# EasyEDA Pro project 轮足机器人主板&核心板.epro, schematic Schematic3
Board Name: 卡座主板V5.0; Create Date: 2025-03-28; Page Name: P1; Project Name: 轮足机器人主板&核心板; Schematic Name: Schematic3; Update Date: 2025-04-25; Company: 海思路999号412所; Drawed: YienMaster; Page Size: A4; Version: V3.0
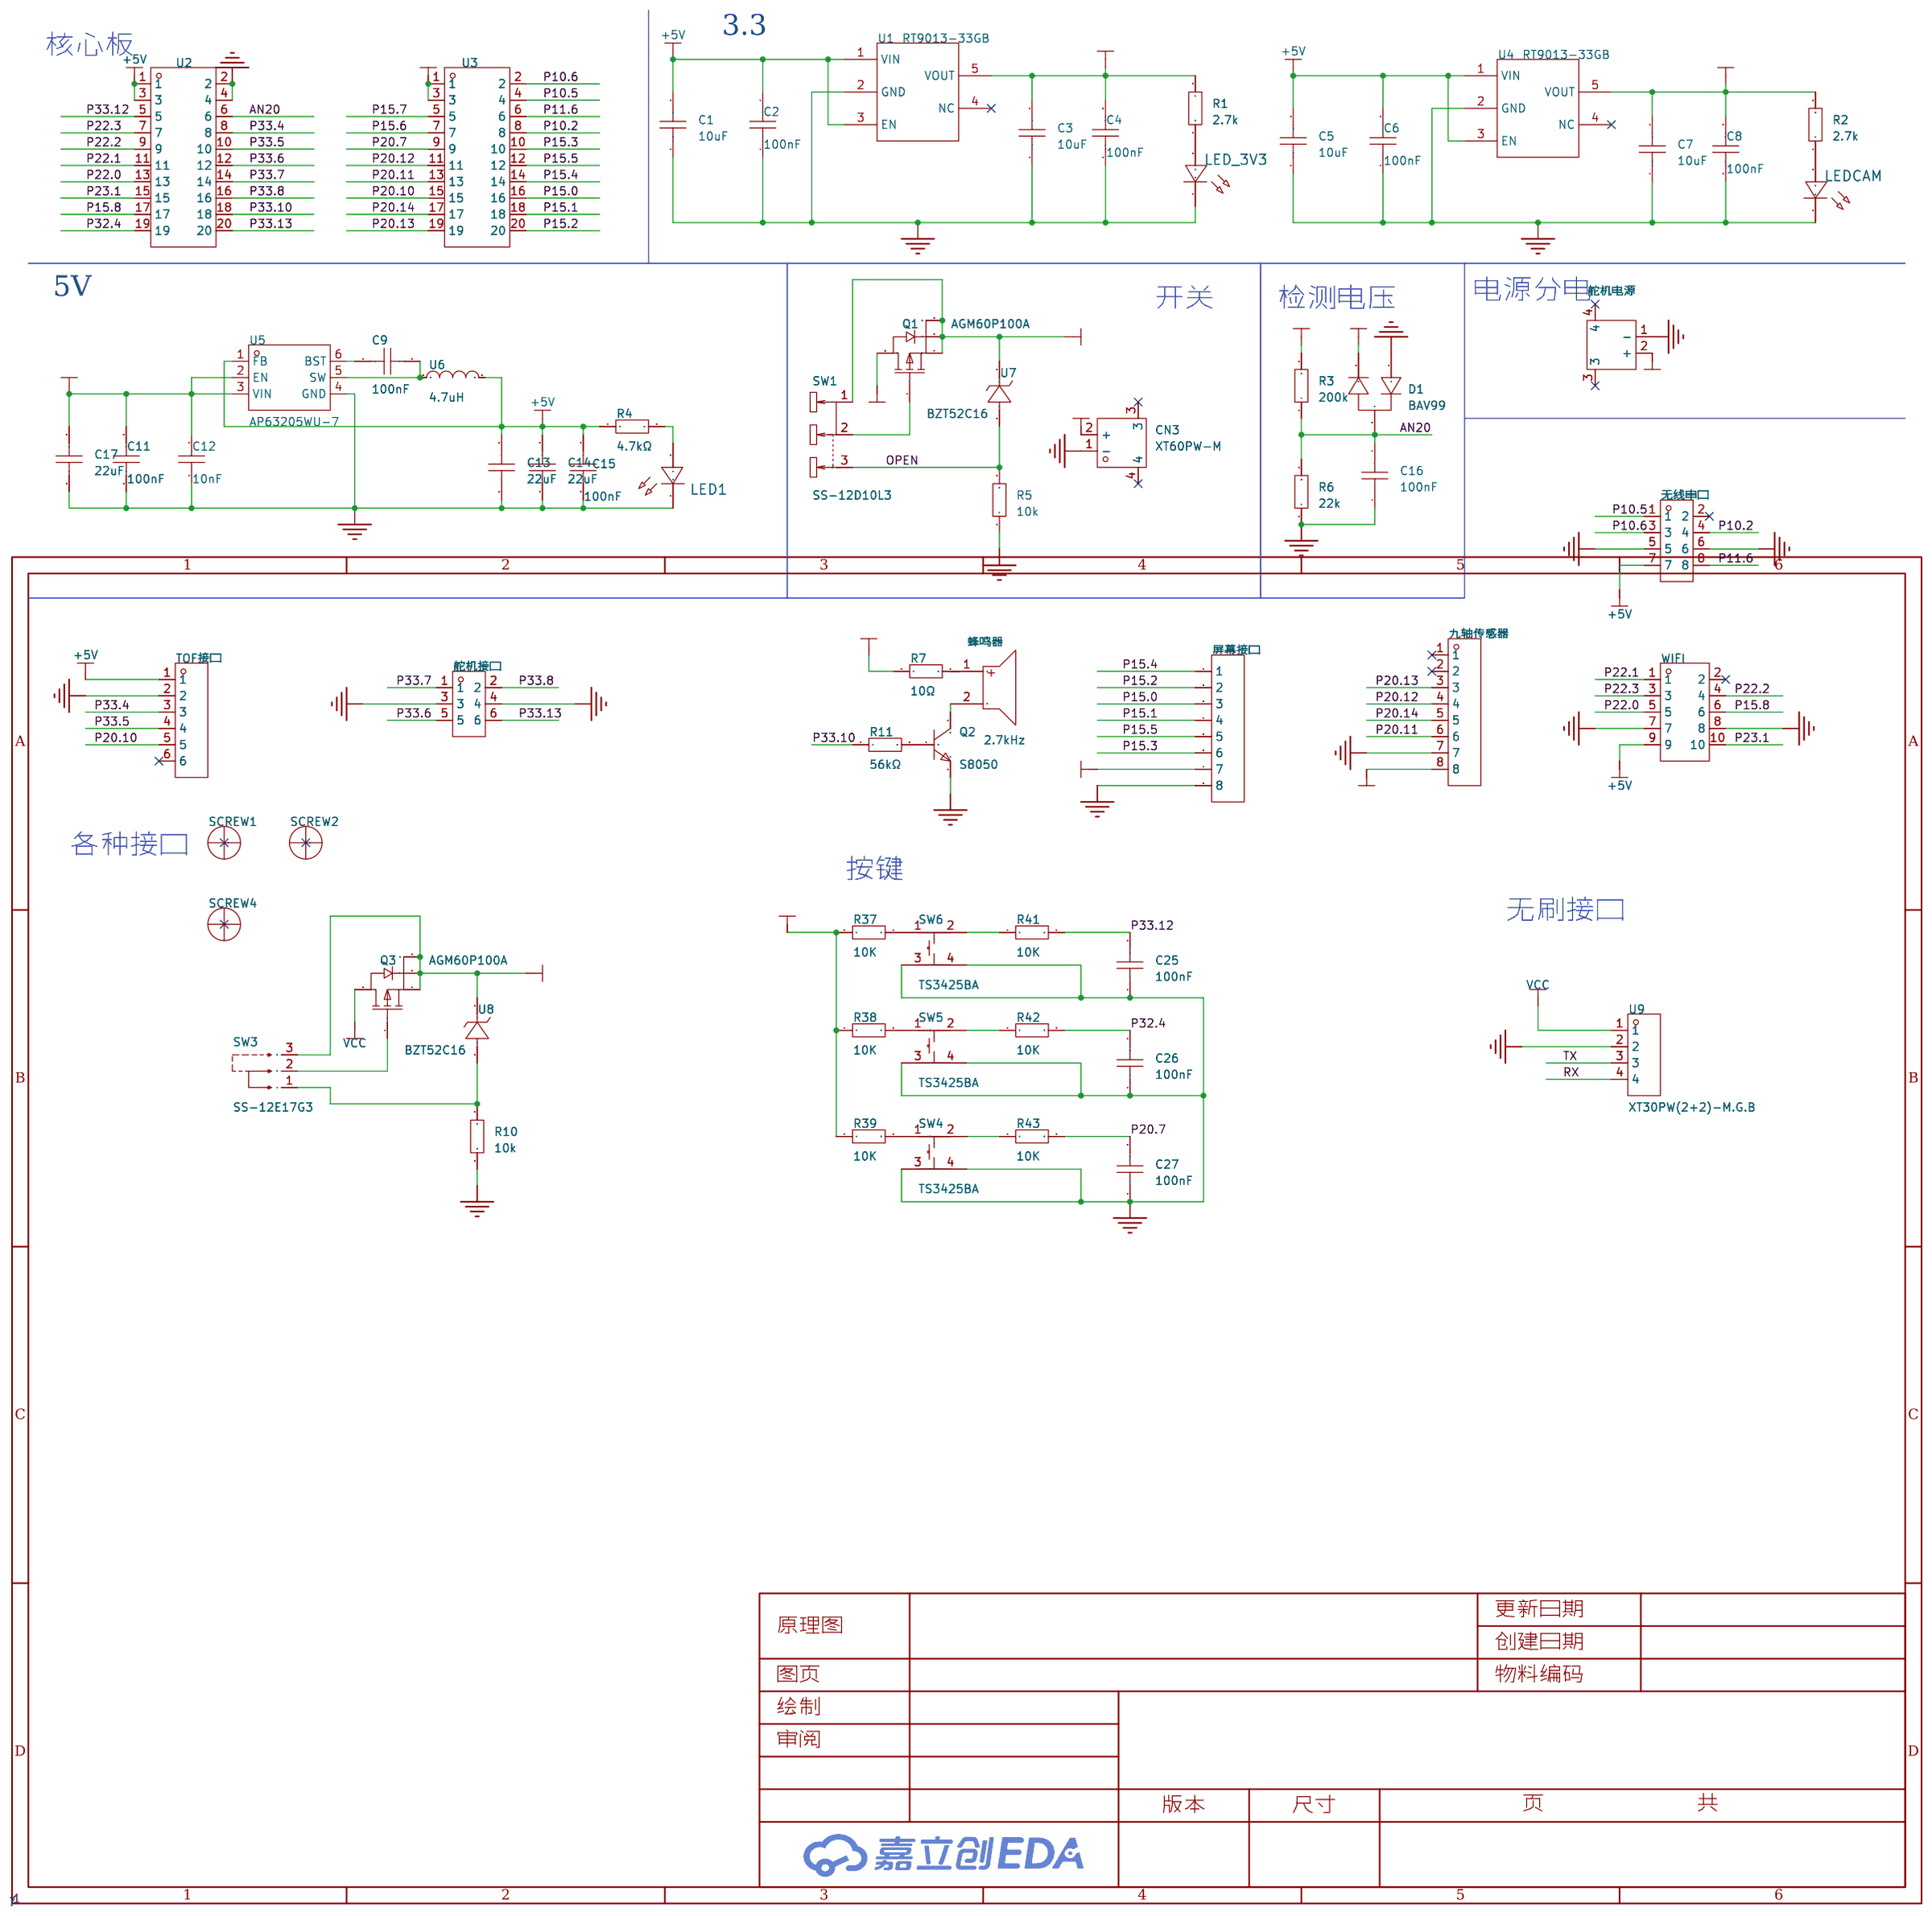
[diagram p6: schematic sheet]

## Parts
C1  10uF  [C0603]
C2  100nF  [C0603]
C3  10uF  [C0603]
C4  100nF  [C0603]
C5  10uF  [C0603]
C6  100nF  [C0603]
C7  10uF  [C0603]
C8  100nF  [C0603]
C9  100nF  [C0603]
C11  100nF  [C0603]
C12  10nF  [C0603]
C13  22uF  [C0805]
C14  22uF  [C0805]
C15  100nF  [C0603]
C16  100nF  [C0603]
C17  22uF  [C0805]
C25  100nF  [C0603]
C26  100nF  [C0603]
C27  100nF  [C0603]
CN3  XT60PW-M  [CONN-TH_XT60PW-M]
D1  BAV99  [SOT-23_L2.9-W1.3-P1.90-LS2.4-BR]
LED1  -  [LED_0603]
LED_3V3  -  [LED_0603]
LEDCAM  -  [LED_0603]
Q1  AGM60P100A  [TDSON-8_L5.9-W5.2-P1.27-BL]
Q2  S8050  [SOT-23-3_L2.9-W1.6-P1.90-LS2.8-BR]
Q3  AGM60P100A  [TDSON-8_L5.9-W5.2-P1.27-BL]
R1  2.7k  [R0603]
R2  2.7k  [R0603]
R3  200k  [R0603]
R4  4.7kΩ  [R0603]
R5  10k  [R0603]
R6  22k  [R0603]
R7  10Ω  [R0603]
R10  10k  [R0603]
R11  56kΩ  [R0603]
R37  10K  [R0603]
R38  10K  [R0603]
R39  10K  [R0603]
R41  10K  [R0603]
R42  10K  [R0603]
R43  10K  [R0603]
SCREW1  -  [M3螺丝]
SCREW2  -  [M3螺丝]
SCREW4  -  [M3螺丝]
SW1  SS-12D10L3  [SW-TH_SS-12D10L3]
SW3  SS-12E17G3  [SW-TH_HOOYA_SS-12E17G3]
SW4  TS3425BA  [SW-SMD_4P-L4.2-W3.2-P2.15-LS4.6-1]
SW5  TS3425BA  [SW-SMD_4P-L4.2-W3.2-P2.15-LS4.6-1]
SW6  TS3425BA  [SW-SMD_4P-L4.2-W3.2-P2.15-LS4.6-1]
TOF接口  ZX-XH2.54-6PWZ  [CONN-TH_6P-P2.50_ZX-XH2.54-6PWZ]
U1  RT9013-33GB  [SOT-23-5_L3.0-W1.7-P0.95-LS2.8-BL]
U2  PM254-2-10-Z-8.5  [HDR-TH_20P-P2.54-V-F-R2-C10-S2.54]
U3  PM254-2-10-Z-8.5  [HDR-TH_20P-P2.54-V-F-R2-C10-S2.54]
U4  RT9013-33GB  [SOT-23-5_L3.0-W1.7-P0.95-LS2.8-BL]
U5  AP63205WU-7  [TSOT-23-6_L2.9-W1.6-P0.95-LS2.8-BL]
U6  4.7uH  [IND-SMD_L3.0-W3.0_FTC303020D]
U7  BZT52C16  [SOD-123_L2.7-W1.6-LS3.8-RD]
U8  BZT52C16  [SOD-123_L2.7-W1.6-LS3.8-RD]
U9  XT30PW(2+2)-M.G.B  [CONN-TH_4P-XT30PW-M]
WIFI  2541FV-2x5P  [HDR-TH_10P-P2.54-V-F-R2-C5-S2.54]
九轴传感器  PZ254V-11-08P  [HDR-TH_8P-P2.54-V-M]
屏幕接口  2.54-1*8P母环保  [HDR-TH_8P-P2.54-V-F-1]
无线串口  2541FV-2x4P  [HDR-TH_8P-P2.54-V-F-R2-C4-S2.54]
舵机接口  BH254V-6P  [IDC-TH_6P-P2.54-V-R2-C3-S2.54]
舵机电源  XT30PW-M30.G.Y  [CONN-TH_XT30PW-M]
蜂鸣器  2.7kHz  [BUZ-TH_BD9.0-P4.00-D0.6-FD]

## Library data of the parts
C1 C3 C5 C7 = CGA0603X5R106K100JT: 容值:10uF;精度:±10%;额定电压:10V;材质(温度系数):X5R;; LCSC Part Name: 10uF ±10% 10V; Supplier Part: C6119842; Manufacturer: HRE(芯声); Supplier Footprint: 0603; JLCPCB Part Class: 扩展库; Supplier: LCSC; Tolerance: ±10%; Voltage Rated: 10V; Temperature Coefficient: X5R
C2 C4 C6 C8 = CC0603KRX7R9BB104: 容值:100nF;精度:±10%;额定电压:50V;材质(温度系数):X7R;; LCSC Part Name: 100nF ±10% 50V; Supplier Part: C14663; Manufacturer: YAGEO(国巨); Supplier Footprint: 0603; JLCPCB Part Class: 基础库; Datasheet: https://atta.szlcsc.com/upload/public/pdf/source/20180910/C282072_33301C7F631E79921B82A8DAC6BCC5B3.pdf; Supplier: LCSC; Tolerance: ±10%; Voltage Rated: 50V; Temperature Coefficient: X7R
C9 C11 C15 = CGA0603X7R104K500JT: 容值:100nF;精度:±10%;额定电压:50V;材质(温度系数):X7R;; LCSC Part Name: 100nF ±10% 50V; Supplier Part: C6119867; Manufacturer: HRE(芯声); Supplier Footprint: 0603; JLCPCB Part Class: 扩展库; Supplier: LCSC; Tolerance: ±10%; Voltage Rated: 50V; Temperature Coefficient: X7R
C12 = CC0603KRX7R9BB103: 容值:10nF;精度:±10%;额定电压:50V;材质(温度系数):X7R;; LCSC Part Name: 10nF ±10% 50V; Supplier Part: C100042; Manufacturer: YAGEO(国巨); Supplier Footprint: 0603; JLCPCB Part Class: 扩展库; Datasheet: https://atta.szlcsc.com/upload/public/pdf/source/20181008/C309510_22F155564471FAF6A489F7D68F34234E.pdf; Supplier: LCSC; Tolerance: ±10%; Voltage Rated: 50V; Temperature Coefficient: X7R
C13 C14 C17 = CGA0805X5R226M350MT: 容值:22uF;精度:±20%;额定电压:35V;材质(温度系数):X5R;; LCSC Part Name: 22uF ±20% 35V; Supplier Part: C6119901; Manufacturer: HRE(芯声); Supplier Footprint: 0805; JLCPCB Part Class: 扩展库; Datasheet: https://atta.szlcsc.com/upload/public/pdf/source/20231129/D589D0CC4D260F7AC3A77E53B455CCB3.pdf; Supplier: LCSC; Tolerance: ±20%; Voltage Rated: 35V; Temperature Coefficient: X5R
C16 C25-C27 = CAP_0603: Supplier Footprint: 0603
CN3 = XT60PW-M: 类别:-;类型1:-;; LCSC Part Name: AMASS(艾迈斯)航模插头xt60连接器150公母对接pw锂电池公头 板插卧式XT60PW-M; Supplier Part: C98732; Manufacturer: AMASS(艾迈斯); JLCPCB Part Class: 扩展库; Datasheet: https://atta.szlcsc.com/upload/public/pdf/source/20240118/44A3DCFF53BE25DC65378AFFB21277A4.pdf; Supplier: LCSC; Brand: 艾迈斯; Type: 卧式插头; Colour: 黄色; InterfaceType: 公头
D1 = BAV99_C408392: 二极管配置:1对串联式;正向压降(Vf):1.25V@150mA;直流反向耐压(Vr):70V;整流电流:200mA;反向恢复时间(trr):6ns;; LCSC Part Name: 电压:70V 电流:200mA; Supplier Part: C408392; Manufacturer: MDD(辰达半导体); Supplier Footprint: SOT-23; JLCPCB Part Class: 扩展库; Datasheet: https://atta.szlcsc.com/upload/public/pdf/source/20240710/712A41600A6652723ABF2FD56C16FE3C.pdf; Supplier: LCSC; Diode Configuration: 1对串联式; Forward Voltage (Vf@If): 1.25V@150mA; Reverse Voltage (Vr): 70V; Rectified Current: 200mA; Reverse Leakage Current: 2.5uA@70V; Reverse Recovery Time (trr): 6ns
LED1 LED_3V3 LEDCAM = LED_0603-R: Supplier Footprint: 0603
Q1 Q3 = AGM60P100A: 类型:1个P沟道;漏源电压(Vdss):60V;连续漏极电流(Id):100A;导通电阻(RDS(on)@Vgs,Id):5.5mΩ@10V,15A;功率(Pd):150W;阈值电压(Vgs(th)@Id):2V@250uA;; LCSC Part Name: 1个P沟道 耐压:60V 电流:100A; Supplier Part: C5373096; Manufacturer: AGM-Semi(芯控源); Supplier Footprint: PDFN-8(5x6); JLCPCB Part Class: 扩展库; Datasheet: https://atta.szlcsc.com/upload/public/pdf/source/20241108/A068B77F4A82E836D758702AA2819D88.pdf; Supplier: LCSC; Type: 1个P沟道; Drain Source Voltage (Vdss): 60V; Continuous Drain Current (Id): 100A; Drain Source On Resistance (RDS(on)@Vgs,Id): 5.5mΩ@10V,15A; Power Dissipation (Pd): 150W; Gate Threshold Voltage (Vgs(th)@Id): 2V@250uA; Total Gate Charge (Qg@Vgs): 56nC@10V; Operating Temperature: -55℃~+150℃@(Tj)
Q2 = S8050_C181158: 晶体管类型:NPN;集电极电流(Ic):500mA;集射极击穿电压(Vceo):25V;功率(Pd):300mW;; LCSC Part Name: NPN 电流:500mA 耐压:25V; Supplier Part: C181158; Manufacturer: Hottech(合科泰); Supplier Footprint: SOT-23; JLCPCB Part Class: 扩展库; Datasheet: https://atta.szlcsc.com/upload/public/pdf/source/20220506/D987F39D56F2975D34EC7947E75C4ABC.pdf; Supplier: LCSC; Transistor Type: NPN; Collector Current (Ic): 500mA; Collector-Emitter Breakdown Voltage (Vceo): 25V; Power Dissipation (Pd): 300mW; Transition Frequency (fT): 150MHz; Collector Cut-Off Current (Icbo): 100nA; Collector-Emitter Saturation Voltage (VCE(sat)@Ic,Ib): 600mV@500mA,50mA
R1-R3 R5 R6 R10 R37-R39 R41-R43 = Res_0603: Supplier Footprint: 0603
R4 = 0603WAF4701T5E: 电阻类型:厚膜电阻;阻值:4.7kΩ;精度:±1%;功率:100mW;最大工作电压:75V;温度系数:±100ppm/℃;; LCSC Part Name: 4.7kΩ ±1% 100mW 厚膜电阻; Supplier Part: C23162; Manufacturer: UNI-ROYAL(厚声); Supplier Footprint: 0603; JLCPCB Part Class: 基础库; Datasheet: https://atta.szlcsc.com/upload/public/pdf/source/20200306/C422600_1E6D84923E4A46A82E41ADD87F860B5C.pdf; Supplier: LCSC; Type: 厚膜电阻; Tolerance: ±1%; Power(Watts): 100mW; Overload Voltage (Max): 75V; Temperature Coefficient: ±100ppm/℃; Operating Temperature Range: -55℃~+155℃
R7 = 0603WAF100JT5E: 电阻类型:厚膜电阻;阻值:10Ω;精度:±1%;功率:100mW;最大工作电压:75V;温度系数:±400ppm/℃;; LCSC Part Name: 10Ω ±1% 100mW 厚膜电阻; Supplier Part: C22859; Manufacturer: UNI-ROYAL(厚声); Supplier Footprint: 0603; JLCPCB Part Class: 基础库; Datasheet: https://atta.szlcsc.com/upload/public/pdf/source/20200306/C422600_1E6D84923E4A46A82E41ADD87F860B5C.pdf; Supplier: LCSC; Type: 厚膜电阻; Tolerance: ±1%; Power(Watts): 100mW; Overload Voltage (Max): 75V; Temperature Coefficient: ±400ppm/℃; Operating Temperature Range: -55℃~+155℃
R11 = 0603WAF5602T5E: 电阻类型:厚膜电阻;阻值:56kΩ;精度:±1%;功率:100mW;最大工作电压:75V;温度系数:±100ppm/℃;; LCSC Part Name: 56kΩ ±1% 100mW 厚膜电阻; Supplier Part: C23206; Manufacturer: UNI-ROYAL(厚声); Supplier Footprint: 0603; JLCPCB Part Class: 基础库; Datasheet: https://atta.szlcsc.com/upload/public/pdf/source/20200306/C422600_1E6D84923E4A46A82E41ADD87F860B5C.pdf; Supplier: LCSC; Type: 厚膜电阻; Tolerance: ±1%; Power(Watts): 100mW; Overload Voltage (Max): 75V; Temperature Coefficient: ±100ppm/℃; Operating Temperature Range: -55℃~+155℃
SCREW1 SCREW2 SCREW4 = M3螺丝: Check: false
SW1 = SS-12D10L3: 电路结构:单刀双掷;安装方式:直插;开关颜色:黑色;额定电流(DC):3A;额定电压(DC):125V;额定电流(AC):3A;额定电压(AC):125V;机械寿命:1万次;; LCSC Part Name: 柄长3mm 直插双档 滑动开关; Supplier Part: C319013; Manufacturer: XKB Connectivity(中国星坤); Supplier Footprint: 插件; JLCPCB Part Class: 扩展库; Datasheet: https://atta.szlcsc.com/upload/public/pdf/source/20211009/D6412F37AABE6F9459A6EE7FA4DAEADB.pdf; Supplier: LCSC; Circuit: 单刀双掷; Actuator Style: 矩形柱状; Pin Style: PC引脚; Switch Length: 13mm; Switch Width: 6.8mm; Switch Height: 6.4mm; Mounting Style: 直插; Actuator Color: 黑色; Current Rating (DC): 3A; Voltage Rating (DC): 125V; Current Rating (AC): 3A; Voltage Rating (AC): 125V; Mechanical Life: 1万次; Operating Temperature: -40℃~+85℃
SW3 = SS-12E17G3: 单排正拨3脚立式拨动开关滑动开关; Supplier Part: C2939320; Manufacturer: HOOYA(皓宇电子); Supplier Footprint: 插件,4.1x11.6mm; JLCPCB Part Class: 扩展库; Datasheet: https://atta.szlcsc.com/upload/public/pdf/source/20220518/A9354BB9F65922345E6D18CC46FE6A81.pdf; Supplier: LCSC
SW4-SW6 = TS3425BA: 电路结构:单刀单掷;按钮形状:椭圆形按钮;作用力:250gf;安装方式:立贴;开关长度:4.2mm;开关宽度:3.2mm;开关高度:2.5mm;带支架:不带;触点电流:50mA;额定电压(DC):12V;绝缘电阻:100MΩ;机械寿命:10万次;; LCSC Part Name: 4.2*3.2*2.5mm 立贴 轻触开关; Supplier Part: C2681476; Manufacturer: SHOU HAN(首韩); Supplier Footprint: SMD; JLCPCB Part Class: 扩展库; Datasheet: https://atta.szlcsc.com/upload/public/pdf/source/20210107/C2681476_BF217B2301F0070AA49504CB0BFDE895.pdf; Supplier: LCSC; Circuit: 单刀单掷; Actuator Style: 椭圆形按钮; Operating Force: 250gf; Mounting Style: 立贴; Switch Length: 4.2mm; Switch Width: 3.2mm; Switch Height: 2.5mm; Strike Gundam: 不带; Contact Current: 50mA; Voltage Rating (DC): 12V; Insulation Resistance: 100MΩ; Actuator/Cap Color: 白色; Pin Style: J型引脚; Mechanical Life: 10万次; Operating Temperature: -20℃~+85℃
TOF接口 = ZX-XH2.54-6PWZ: 插针结构:1x6P;间距:2.5mm;安装方式:弯插;参考系列:XH;总PIN数:6P;排数:1;每排PIN数:6;行距:-;额定电流:3A;触头材质:黄铜;触头镀层:锡;工作温度范围:-25℃~+85℃;; LCSC Part Name: 1x6P 间距:2.5mm 弯插 系列:XH; Supplier Part: C7429645; Manufacturer: Megastar(兆星); Supplier Footprint: 弯插,P=2.5mm; JLCPCB Part Class: Extended Part; Datasheet: https://atta.szlcsc.com/upload/public/pdf/source/20230619/9057EB94260093B1525D11E652DE2D7A.pdf; Supplier: LCSC; Pins Structure: 1x6P; Pitch: 2.5mm; Mounting Type: 弯插; Reference Series: XH; Number of Pins: 6P; Number of Rows: 1; Number of PINs Per Row: 6; Rated Current: 3A; Contact Material: 黄铜; Contact Plating: 锡; Operating Temperature: -25℃~+85℃; Rated Voltage (Max): 250V; Plastic Material: PA66; Flame Retardant Rating: UL94V-0; Color: 白色; Z-Height of the Board: 5.9mm; X-Length of Bottom Edge on Board (Spacing Line): 17.5mm; Y-Width of Bottom Edge on Board: 7.32mm
U1 U4 = RT9013-33GB: 输出类型:固定;最大输入电压:5.5V;输出电压:3.3V;最大输出电流:500mA;电源纹波抑制比(PSRR):50dB@(10kHz);输出极性:正极;; LCSC Part Name: 输入5.5V 输出3.3V 500mA; Supplier Part: C47773; Manufacturer: RICHTEK(立锜); Supplier Footprint: SOT-23-5; JLCPCB Part Class: 扩展库; Datasheet: https://atta.szlcsc.com/upload/public/pdf/source/20150504/1457707282459.pdf; Supplier: LCSC; Output Type: 固定; Maximum Input Voltage: 5.5V; Output Voltage: 3.3V; MAX Output Current: 500mA; Power Supply Rejection Ratio (PSRR): 50dB@(10kHz); Dropout Voltage: 400mV@(500mA); standby current: 50uA; Operating Temperature: -40℃~+85℃; Output Polarity: 正极; Number of Outputs: 1
U2 U3 = PM254-2-10-Z-8.5: 插孔结构:2x10P;间距:2.54mm;行距:2.54mm;圆孔/方孔:方孔;安装类型:直插;排数:双排;总孔位数:20P;额定电流:3A;额定电压:-;插孔方向:顶部;塑高:8.5mm;触头材质:铜合金;工作温度范围:-40℃~+105℃;焊接温度(最大值):260℃@5S;; LCSC Part Name: 2x10P 间距:2.54mm 直插; Supplier Part: C2897411; Manufacturer: HCTL(华灿天禄); Supplier Footprint: 插件,P=2.54mm; JLCPCB Part Class: 扩展库; Datasheet: https://atta.szlcsc.com/upload/public/pdf/source/20230609/3D36CA2C1BFC9FD1C3F709AD9DFEB9C2.pdf; Supplier: LCSC; Holes Structure: 2x10P; Pitch: 2.54mm; Row Spacing: 2.54mm; Circular Hole / Square Hole: 方孔; Mounting Type: 直插; Number of Rows: 双排; Number of Holes: 20P; Current Rating (Max): 3A; Holes Direction: 顶部; Insulation Height: 8.5mm; Contact Material: 铜合金; Operating Temperature Range: -40℃~+105℃; Soldering Temperature(Max): 260℃@5S
U5 = AP63205WU-7: 功能类型:降压型;输出类型:固定;输入电压:3.8V~32V;输出电压:5V;输出电流:2A;; LCSC Part Name: 3.8V至32V输入、2A低静态电流同步降压转换器，增强EMI抑制; Supplier Part: C2071056; Manufacturer: DIODES(美台); Supplier Footprint: TSOT-23-6; JLCPCB Part Class: 扩展库; Datasheet: https://atta.szlcsc.com/upload/public/pdf/source/20210622/C780769_099C67289BD3EC61AAFB52D8B07125B3.pdf; Supplier: LCSC; Function: 降压型; Output Type: 固定; Input Voltage: 3.8V~32V; Output Voltage: 5V; Output Current: 2A; Switching Frequency: 1.1MHz; Operating Temperature: -40℃~+85℃@(TA); Synchronous Rectification: 是; Number of Outputs: 1; Topology: 降压式; Quiescent Current (Iq): 22uA; Switch tube (built-in/external): 内置
U6 = FTC303018D4R7MBCA: 电感值:4.7uH;精度:±20%;额定电流:3.4A;饱和电流(Isat):4.7A;类型:一体成型电感;; LCSC Part Name: 4.7uH ±20% 4.7A; Supplier Part: C5832388; Manufacturer: cjiang(长江微电); Supplier Footprint: SMD,3x3mm; JLCPCB Part Class: 扩展库; Datasheet: https://atta.szlcsc.com/upload/public/pdf/source/20230602/8FFEDA9C0247A92A0D4B67554BFE4091.pdf; Supplier: LCSC; Tolerance: ±20%; Rated Current: 3.4A; Saturation Current (Isat): 4.7A; DC Resistance (DCR): 72mΩ; Type: 一体成型电感
U7 U8 = BZT52C16_C2903915: 二极管配置:独立式;稳压值(标称值):16V;稳压值(范围):15.3V~17.1V;功率(Pd):500mW;; Supplier Part: C2903915; Manufacturer: GOODWORK(固得沃克); Supplier Footprint: SOD-123; JLCPCB Part Class: 扩展库; Datasheet: https://atta.szlcsc.com/upload/public/pdf/source/20211009/D2D840BC467623069B519162AA0DC941.pdf; Supplier: LCSC; Diode Configuration: 独立式; Zener Voltage (Nom): 16V; Reverse Leakage Current (Ir): 100nA@11.2V; Zener Voltage (Range): 15.3V~17.1V; Power Dissipation: 500mW; Zener Impedance (Zzt): 40Ω
U9 = XT30PW(2+2)-M.G.B: LCSC Part Name: XT30PW(2+2)功率数据混合插头公金黑PCB弯插; Supplier Part: C19268030; Manufacturer: AMASS(艾迈斯); JLCPCB Part Class: 扩展库; Datasheet: https://atta.szlcsc.com/upload/public/pdf/source/20240112/A815AE62CB016131F8636555ECBDABF7.pdf; Supplier: LCSC
WIFI = 2541FV-2x5P: 插孔结构:2x5P;间距:2.54mm;圆孔/方孔:方孔;安装类型:直插;排数:双排;总孔位数:10P;额定电流:3A;额定电压:250V;插孔方向:顶部;工作温度范围:-40℃~+105℃;; LCSC Part Name: 间距:2.54mm 2x5P 直插; Supplier Part: C18723056; Manufacturer: HanElectricity(瀚源); Supplier Footprint: 插件,P=2.54mm; JLCPCB Part Class: 扩展库; Datasheet: https://atta.szlcsc.com/upload/public/pdf/source/20231018/348A30CBB18FAA04E40F2CE12A6EAA75.pdf; Supplier: LCSC; Holes Structure: 2x5P; Pitch: 2.54mm; Circular Hole / Square Hole: 方孔; Mounting Type: 直插; Number of Rows: 双排; Number of Holes: 10P; Current Rating (Max): 3A; Voltage Rating (Max): 250V; Holes Direction: 顶部; Operating Temperature Range: -40℃~+105℃
九轴传感器 = PZ254V-11-08P: 插针结构:1x8P;间距:2.54mm;行距:-;圆针/方针:方针;安装类型:直插;排数:单排;总PIN位数:8P;额定电流:-;额定电压:-;配合针长度:6mm;塑高:2.5mm;端接针长度:3mm;触头材质:黄铜;触头镀层:-;工作温度范围:-40℃~+105℃;颜色:黑色;; LCSC Part Name: 间距:2.54mm 1x8P 直插 方针; Supplier Part: C492407; Manufacturer: XFCN(兴飞); Supplier Footprint: 插件,P=2.54mm; JLCPCB Part Class: 扩展库; Datasheet: https://atta.szlcsc.com/upload/public/pdf/source/20200309/C492407_83A6FB26A2233368EDB9516968EC6149.pdf; Supplier: LCSC; Pin Structure: 1x8P; Pitch: 2.54mm; Circluar Pins/Square Pins: 方针; Mounting Type: 直插; Number of Rows: 单排; Number of Pins: 8P; Length of Mating Pin: 6mm; Insulation Height: 2.5mm; Length of End Connection Pin: 3mm; Contact Material: 黄铜; Operating Temperature Range: -40℃~+105℃; Color: 黑色
屏幕接口 = 2.54-1*8P母环保: 插孔结构:1x8P;间距:2.54mm;行距:-;安装类型:直插;排数:单排;总孔位数:8P;塑高:-;触头材质:-;触头镀层:-;; LCSC Part Name: 间距:2.54mm 1x8P 直插; Supplier Part: C27438; Manufacturer: BOOMELE(博穆精密); Supplier Footprint: 插件,P=2.54mm; JLCPCB Part Class: 扩展库; Datasheet: https://atta.szlcsc.com/upload/public/pdf/source/20231221/1CA800C6799ED97958773716FAA1BFFE.pdf; Supplier: LCSC; Holes Structure: 1x8P; Pitch: 2.54mm; Mounting Type: 直插; Number of Rows: 单排; Number of Holes: 8P
无线串口 = 2541FV-2x4P: 插孔结构:2x4P;间距:2.54mm;圆孔/方孔:方孔;安装类型:直插;排数:双排;总孔位数:8P;额定电流:3A;额定电压:250V;插孔方向:顶部;工作温度范围:-40℃~+105℃;; LCSC Part Name: 间距:2.54mm 2x4P 直插; Supplier Part: C18723055; Manufacturer: HanElectricity(瀚源); Supplier Footprint: 插件,P=2.54mm; JLCPCB Part Class: 扩展库; Datasheet: https://atta.szlcsc.com/upload/public/pdf/source/20231018/348A30CBB18FAA04E40F2CE12A6EAA75.pdf; Supplier: LCSC; Holes Structure: 2x4P; Pitch: 2.54mm; Circular Hole / Square Hole: 方孔; Mounting Type: 直插; Number of Rows: 双排; Number of Holes: 8P; Current Rating (Max): 3A; Voltage Rating (Max): 250V; Holes Direction: 顶部; Operating Temperature Range: -40℃~+105℃
舵机接口 = BH254V-6P: 连接器类型:简牛座;间距:2.54mm;结构:2x3P;额定电流:3A;额定电压:250V;封装形式:直插;行距:2.54mm;排数:2;每排PIN数:3;工作温度范围:-40℃~+105℃;; LCSC Part Name: 2.54mm 2x3P 排数:2 每排P数:3; Supplier Part: C492441; Manufacturer: XFCN(兴飞); Supplier Footprint: 插件,P=2.54mm; JLCPCB Part Class: 扩展库; Datasheet: https://atta.szlcsc.com/upload/public/pdf/source/20200312/C492444_4AABE2FC4F6BE8226B85135616AF0092.pdf; Supplier: LCSC; Connector Type: 简牛座; Pitch: 2.54mm; Structure: 2x3P; Current Rating (Max): 3A; Voltage Rating (Max): 250V; Holder Type: 直插; Row Spacing: 2.54mm; Number of Rows: 2; Pin Number in each Row: 3; Operating Temperature Range: -40℃~+105℃
舵机电源 = XT30PW-M30.G.Y: 类别:-;类型1:-;; LCSC Part Name: AMASS(艾迈斯)航模插头 卧式弯脚 XT30PW-M公头; Supplier Part: C431092; Manufacturer: AMASS(艾迈斯); JLCPCB Part Class: 扩展库; Datasheet: https://atta.szlcsc.com/upload/public/pdf/source/20220222/6A9F22F7850E25B33E1BE430ADF8560B.pdf; Supplier: LCSC; Type: 航模插头; RatedVoltage: DC 500V; InterfaceType: 公头; RatedCurrent: 15A; RecommendedWireGauge: 16/18/20AWG; contact resistance: 1.2mΩ; specifications: 2pin
蜂鸣器 = QMB-09B-03: 驱动方式:无源(外部驱动);构造类型:电磁式;频率:2.7kHz;声压(SPL):85dB@3V,10cm;; LCSC Part Name: 无源蜂鸣器QMB-09B-03; Supplier Part: C96256; Manufacturer: 华能; Supplier Footprint: 插件,D=9mm; JLCPCB Part Class: 扩展库; Datasheet: https://atta.szlcsc.com/upload/public/pdf/source/20210401/C96256_958B17753B5AD7CBFBCFFC7C095B4484.pdf; Supplier: LCSC; Oscillator Circuit: 无源(外部驱动); Technology Type: 电磁式; Operating Voltage: 2V~5V; Sound Pressure Level (SPL): 85dB@3V,10cm; Diameter (φD): 9mm; Height: 5.7mm

## Nets
+5V: C1.2 C2.2 C5.2 C6.2 C13.2 C14.2 C15.1 R4.1 TOF接口.1 U1.1(VIN) U1.3(EN) U2.1 U2.3 U4.1(VIN) U4.3(EN) U5.1(FB) U6.2 WIFI.9 无线串口.7
GND: C1.1 C2.1 C3.1 C4.1 C5.1 C6.1 C7.1 C8.1 C11.1 C12.1 C13.1 C14.1 C15.2 C16.1 C17.1 C25.1 C26.1 C27.1 CN3.1(-) D1.1 LED1.1(C) LED_3V3.1(C) LEDCAM.1(C) Q2.2 R5.1 R6.1 R10.1 SW4.3 SW4.4 SW5.3 SW5.4 SW6.3 SW6.4 TOF接口.2 U1.2(GND) U2.2 U2.4 U4.2(GND) U5.4(GND) U9.2 WIFI.7 WIFI.8 九轴传感器.7 屏幕接口.8 无线串口.5 无线串口.6 舵机接口.3 舵机接口.4 舵机电源.1(-)
VCC: Q3.5(D) U9.1
VCC3V3: C3.2 C4.2 D1.2 R1.2 R7.1 R37.1 R38.1 R39.1 U1.5(VOUT) 九轴传感器.8 屏幕接口.7
VCCCAM: C7.2 C8.2 R2.2 U3.1 U3.3 U4.5(VOUT)
VIN_BAT: C11.2 C12.2 C17.2 Q1.5(D) Q3.1(S) Q3.2(S) Q3.3(S) R3.2 SW3.3 U5.2(EN) U5.3(VIN) U8.1(K) 舵机电源.2(+)
AN20: C16.2 D1.3 R3.1 R6.2 U2.6
DCIN: CN3.2(+) Q1.1(S) Q1.2(S) Q1.3(S) SW1.1 U7.1(K)
OPEN: R5.2 SW1.3 U7.2(A)
P10.2: U3.8 无线串口.4
P10.5: U3.4 无线串口.1
P10.6: U3.2 无线串口.3
P11.6: U3.6 无线串口.8
P15.0: U3.16 屏幕接口.3
P15.1: U3.18 屏幕接口.4
P15.2: U3.20 屏幕接口.2
P15.3: U3.10 屏幕接口.6
P15.4: U3.14 屏幕接口.1
P15.5: U3.12 屏幕接口.5
P15.6: U3.7
P15.7: U3.5
P15.8: U2.17 WIFI.6
P20.7: C27.2 R43.2 U3.9
P20.10: TOF接口.5 U3.15
P20.11: U3.13 九轴传感器.6
P20.12: U3.11 九轴传感器.4
P20.13: U3.19 九轴传感器.3
P20.14: U3.17 九轴传感器.5
P22.0: U2.13 WIFI.5
P22.1: U2.11 WIFI.1
P22.2: U2.9 WIFI.4
P22.3: U2.7 WIFI.3
P23.1: U2.15 WIFI.10
P32.4: C26.2 R42.2 U2.19
P33.4: TOF接口.3 U2.8
P33.5: TOF接口.4 U2.10
P33.6: U2.12 舵机接口.5
P33.7: U2.14 舵机接口.1
P33.8: U2.16 舵机接口.2
P33.10: R11.1 U2.18
P33.12: C25.2 R41.2 U2.5
P33.13: U2.20 舵机接口.6
RX: U9.4
TX: U9.3
$1N1518: C9.1 U5.6(BST)
$1N1522: C9.2 U5.5(SW) U6.1
$1N3666: Q2.3 蜂鸣器.2
$1N3671: R7.2 蜂鸣器.1
$1N3951: Q1.4(G) SW1.2
$1N12313: R10.2 SW3.1 U8.2(A)
$1N12314: Q3.4(G) SW3.2
$1N14181: Q2.1 R11.2
$1N18145: R38.2 SW5.1
$1N18147: R39.2 SW4.1
$1N18149: R37.2 SW6.1
$1N18153: R41.1 SW6.2
$1N18183: R42.1 SW5.2
$1N18214: R43.1 SW4.2
Net-(LED1-2): LED1.2(A) R4.2
Net-(LED_3V3-2): LED_3V3.2(A) R1.1
Net-(LEDCAM-2): LEDCAM.2(A) R2.1

Not connected (* = marked no-connect by the designer): CN3 3* 4*; SCREW1 1*; SCREW2 1*; SCREW4 1*; TOF接口 6*; U1 4(NC)*; U4 4(NC)*; WIFI 2*; 九轴传感器 1* 2*; 无线串口 2*; 舵机电源 3* 4*

## Notes on the sheet
- 3.3
- 核心板
- 5V
- 电源分电
- 开关
- 检测电压
- 各种接口
- 按键
- 无刷接口
